# EAGLE design Adafruit NeoKey Trinkey (EAGLE 9.6.2)
AUTHOR: ladyada
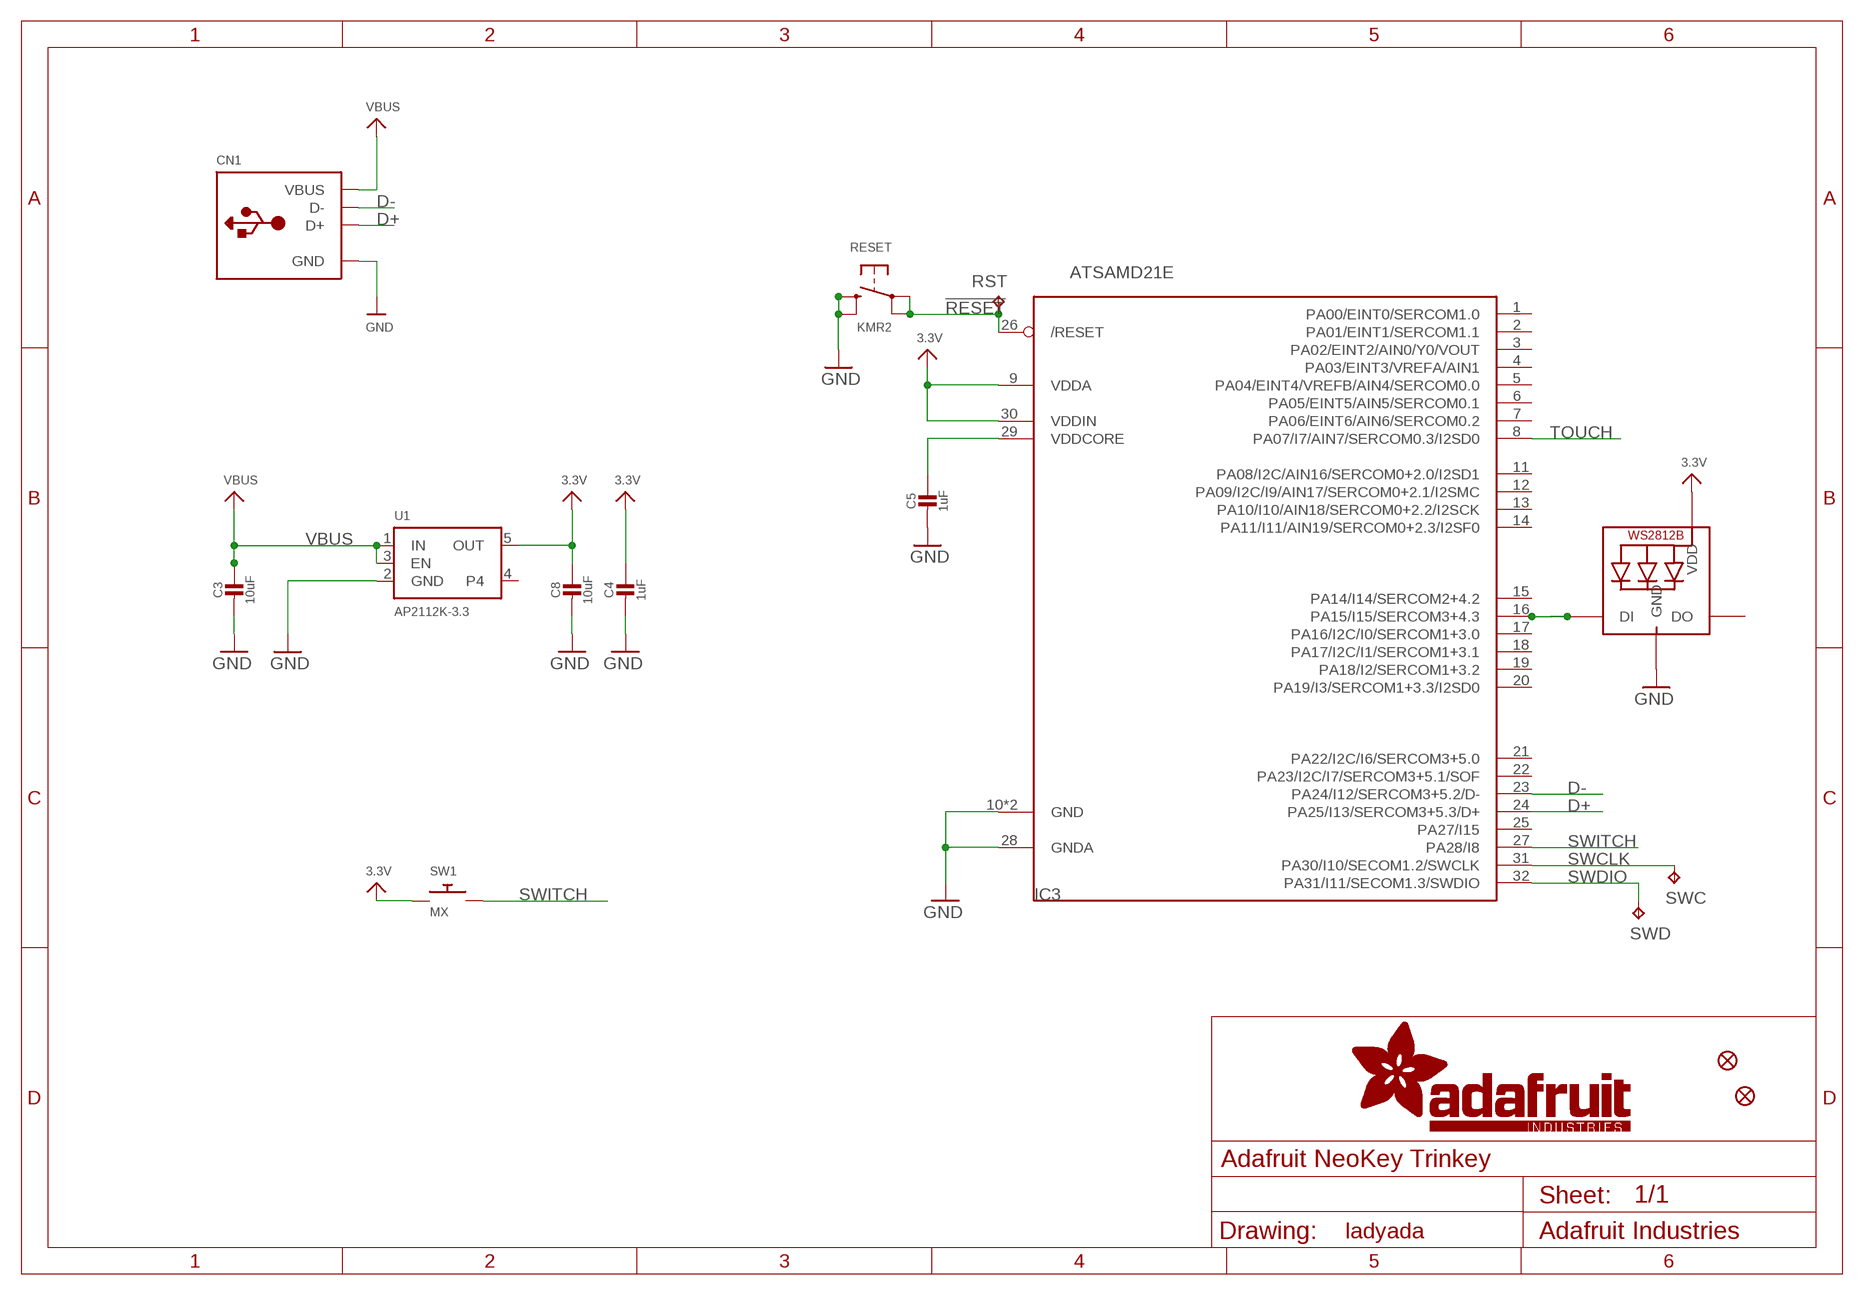
[diagram p0: schematic, sheet 1]

## Parts
C3  10uF  CAP_CERAMIC0805-NOOUTLINE  [0805-NO]
C4  1uF  CAP_CERAMIC0603_NO  [0603-NO]
C5  1uF  CAP_CERAMIC0603_NO  [0603-NO]
C8  10uF  CAP_CERAMIC0805-NOOUTLINE  [0805-NO]
CN1  USB_TYPEAPCB  [USBA_PCB]
FID1  FIDUCIAL_1MM  [FIDUCIAL_1MM]
FID2  FIDUCIAL_1MM  [FIDUCIAL_1MM]
IC3  ATSAMD21E  [QFN32_5MM]
LED1  WS2812B_SK6812E  [NEO3535_REVERSE]
RESET  KMR2  SWITCH_TACT_SMT4.6X2.8  [BTN_KMR2_4.6X2.8]
RST  RST  TPTP16R  [TP16R]
SW1  MX  SWITCH_PUSHBUTTON_KAILH_THMSIMPLE  [KAILH_BOX_MX_NOSTABILIZERS]
SWC  SWC  TPTP15R  [TP15R]
SWD  SWD  TPTP15R  [TP15R]
U1  AP2112K-3.3  VREG_SOT23-5  [SOT23-5]

## Nets
3.3V: C4.1 C8.1 IC3.9(VDDA) IC3.30(VDDIN) LED1.1-VDD(VDD) SW1.1 U1.5(OUT)
!RESET: IC3.26(/RESET) RESET.A'(P1) RESET.A(P) RST.TP
D+: CN1.USB_PLUS(D+) IC3.24(PA25/I13/SERCOM3+5.3/D+)
D-: CN1.USB_NEG(D-) IC3.23(PA24/I12/SERCOM3+5.2/D-)
GND: C3.2 C4.2 C5.2 C8.2 CN1.GND IC3.10(GND) IC3.28(GNDA) IC3.33(GND) LED1.3-GND(GND) RESET.B'(S1) RESET.B(S) U1.2(GND)
N$1: IC3.16(PA15/I15/SERCOM3+4.3) LED1.4-DIN(DI)
SWCLK: IC3.31(PA30/I10/SECOM1.2/SWCLK) SWC.TP
SWDIO: IC3.32(PA31/I11/SECOM1.3/SWDIO) SWD.TP
SWITCH: IC3.27(PA28/I8) SW1.2
TOUCH: IC3.8(PA07/I7/AIN7/SERCOM0.3/I2SD0)
VBUS: C3.1 CN1.VCC(VBUS) U1.1(IN) U1.3(EN)
VDDCORE1: C5.1 IC3.29(VDDCORE)
Unconnected: IC3.1(PA00/EINT0/SERCOM1.0) IC3.2(PA01/EINT1/SERCOM1.1) IC3.3(PA02/EINT2/AIN0/Y0/VOUT) IC3.4(PA03/EINT3/VREFA/AIN1) IC3.5(PA04/EINT4/VREFB/AIN4/SERCOM0.0) IC3.6(PA05/EINT5/AIN5/SERCOM0.1) IC3.7(PA06/EINT6/AIN6/SERCOM0.2) IC3.11(PA08/I2C/AIN16/SERCOM0+2.0/I2SD1) IC3.12(PA09/I2C/I9/AIN17/SERCOM0+2.1/I2SMC) IC3.13(PA10/I10/AIN18/SERCOM0+2.2/I2SCK) IC3.14(PA11/I11/AIN19/SERCOM0+2.3/I2SF0) IC3.15(PA14/I14/SERCOM2+4.2) IC3.17(PA16/I2C/I0/SERCOM1+3.0) IC3.18(PA17/I2C/I1/SERCOM1+3.1) IC3.19(PA18/I2/SERCOM1+3.2) IC3.20(PA19/I3/SERCOM1+3.3/I2SD0) IC3.21(PA22/I2C/I6/SERCOM3+5.0) IC3.22(PA23/I2C/I7/SERCOM3+5.1/SOF) IC3.25(PA27/I15) LED1.2-DOUT(DO) U1.4

## Library data of the parts
C3-C5 C8 = microbuilder:CAP_CERAMIC: Ceramic Capacitors For new designs, use the packages preceded by an '_' character since they are more reliable: The following footprints should be used on most boards: _0402 - Standard footprint for regular board layouts _0603 - Standard footprint for regular board layouts _0805 - Standard footprint for regular board layouts _1206 - Standard footprint for regular board layouts For extremely tight-pitch boards where space is at a premium, the following 'micro-pitch' footprints can be used (smaller pads, no silkscreen outline, etc.): _0402MP - Micro-pitch footprint for very dense/compact boards _0603MP - Micro-pitch footprint for very dense/compact boards _0805MP - Micro-pitch footprint for very dense/compact boards _1206MP - Micro-pitch footprint for very dense/compact boards
CN1 = microbuilder:USB_TYPEA: USB - Type A Connectors Male types stick out and are inserted into a PC or matching females parts (these are the connectors used on USB Memory Sticks, etc.). Female parts are generally used for USB Host and accept a male-type connector. SMT - 4UCON: 10017 PTHFML - Digikey: 609-1045-ND, 4UCon: 05241 PCB - Use 2.0mm thick PCBs with this footprint
FID1 FID2 = microbuilder:FIDUCIAL: Fiducial Alignment Points Various fiducial points for machine vision alignment.; BOM: EXCLUDE
IC3 = microbuilder:ATSAMD21E
LED1 = microbuilder:WS2812B
RESET = microbuilder:SWITCH_TACT_SMT: SMT Tact Switches 6x6mm - Digikey: P12940SCT-ND KMR2 (4.6x2.8mm) - Digikey: 401-1426-1-ND EVQ-PQHB55 - Light Touch, 160GF (4.5x4.5mm) - Digikey: P8090SCT-ND KMT0 - KMT021 NGJ LHS (etc.) IP68/Waterproof - Digikey: CKN10289CT-ND
RST SWC SWD = testpad:TP: Test pad
SW1 = adafruit_electromech:SWITCH_PUSHBUTTON: Buttons SOFTTOUCHSMD_SJ - Soft touch temporary push button (Super Junk Akihabara) Compatible with SKPMANE010 [Mouser: 688-SKPMAN] C&K_KSS = Digikey: KSS221GLFS
U1 = microbuilder:VREG_SOT23-5: SOT23-5 Fixed Voltage Regulators Part Current Out V Out V In V Dropout θJA (°C/W) TJ (°C) Digikey Part No. ADP121 150mA 3.3V 3.4-5.5V 0.09V @ 150mA -- -- ADP121-AUJZ33R7CT-ND ADP121 150mA 3.0V 3.1-5.5V 0.09V @ 150mA -- -- ADP121-AUJZ30R7CT-ND ADP122 300mA 3.3V 3.4-5.5V 0.085V @ 300mA -- -- ADP122AUJZ-3.3-R7CT-ND ADP1712 300mA 3.3V 3.5-5.5V 0.17V @ 300mA -- -- ADP1712AUJZ-3.3-R7TR-ND AP7311 (Low Cost) 150mA 3.3V 3.5-6V 0.15V @ 150mA -- -- AP7311-33WG-7DICT-ND LD39015M18R 150mA 1.8V 1.9V-5.5V 0.08V @ 100mA -- -- 497-6977-1-ND LP2985A-33DBVR 150mA 3.3V 3.3-16V 0.28V @ 150mA 206 150 296-18479-1-ND MCP1824T-3302E/OT 300mA 3.3V 3.5V-6V 0.2V @ 300mA -- -- MCP1824T-3302E/OTCT-ND MIC5205-2.5YM5 TR 150mA 2.5V 2.7-16V 0.165V @ 150mA -- -- 576-1257-2-ND MIC5205-3.0YM5 TR 150mA 3.0V 3.2V-16V 0.165V @ 150mA -- -- 576-1258-2-ND MIC5205-3.3YM5 TR 150mA 3.3V 3.5V-16V 0.165V @ 150mA -- -- 576-1259-2-ND TPS780330220 150mA 3.3V+2.2V 3.6-5.5V 250mV Max -- -- 296-23332-1-ND TDA3663/N1,135 100mA 3.3V 3.5-45V 0.18V @ 50mA -- -- 568-5343-1-ND Max operating temp can be calculated using θJA, TJ (max junction temperature), and power in watts. Set the "Maximum Ambient Temperature" until it reaches TJ ("Max Junction Temperature"), which is the absolute limit for safe use of the regulator: Heat Sink Temperature Calculator <http://www.daycounter.com/Calculators/Heat-Sink-Temperature-Calculator.phtml> For example, With 12V source into a 3.3V LP2985 and a 30mA load, we are dissipating (12V-3.3V) * 0.03A = 0.261W. With a θJA of 206 °C/W, a TJ of 150°C, and 261mW we can safely use the chip without a heat sink up to 75°C (=147.1°C Junction Temperature).

## Board
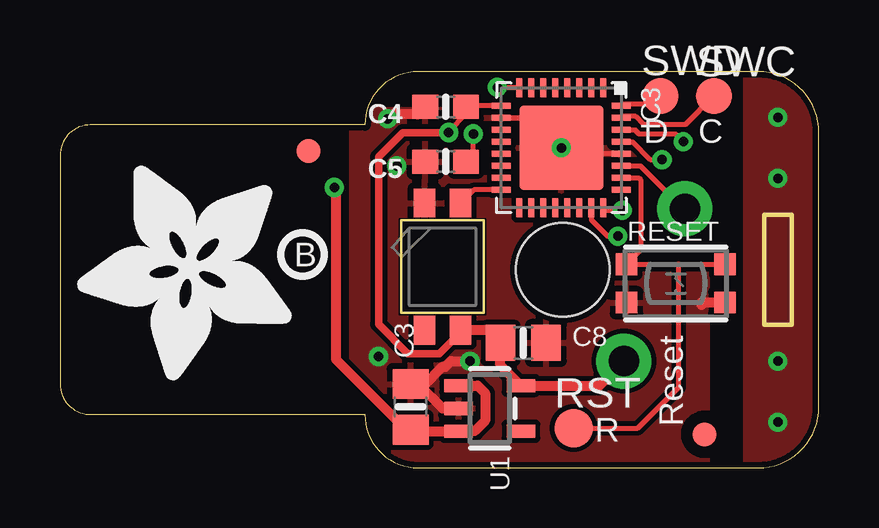
[diagram p1: board, top side]
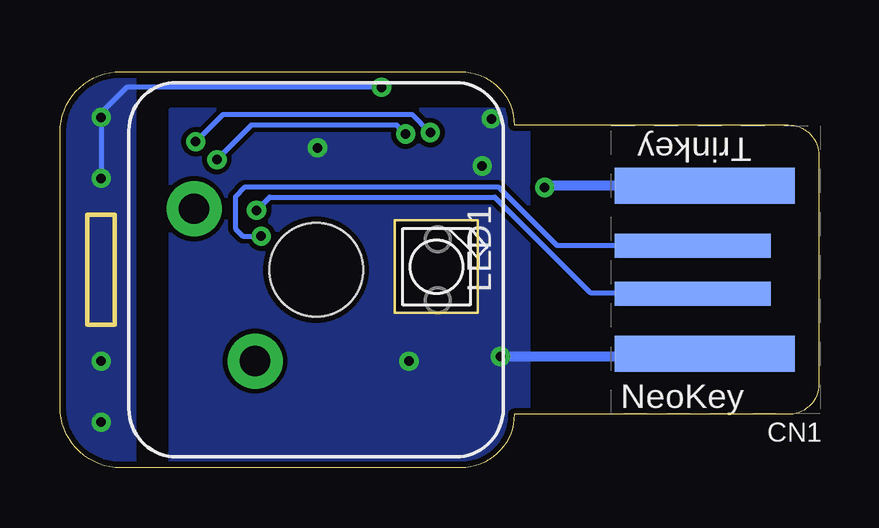
[diagram p2: board, bottom side, seen from below]

Size 31.62 x 16.51 mm. Coordinates in mm from the lower left corner, seen from the top.
Outline: 31.62,4.19 31.62,2.54 arc-90 29.08,0 14.92,0 arc-90 12.7,2.22 1.3,2.22 arc-90 0,3.49 0,13.02 arc-90 1.27,14.29 12.7,14.29 arc-90 14.92,16.51 29.08,16.51 arc-90 31.62,13.97 31.62,3.81
Copper layers (1*16): Top 0.035mm / dielectric 1.5mm / Bottom 0.035mm
Design rules "adafruit 8-8 *": minimum track width 8mil, minimum drill 15.5mil, track to track 8mil, track to pad 8mil, pad to pad 8mil, via to via 8mil, smd to smd 8mil, copper to edge 10mil, drill to drill 8mil, minimum pad ring 10mil, minimum via ring 8mil, stop-mask expansion 2mil, vias tented up to drill 20mil, thermal gap 10mil
Milling: 4 lines

### Footprints (pad centres in the part's own frame; a part is rotated, then mirrored left to right if it is on the bottom)
0805-NO = smd 1.24 x 1.5: 1 -0.95,0; 2 0.95,0
0603-NO = smd 1.075 x 1: 1 -0.85,0; 2 0.85,0
USBA_PCB = smd 7.5 x 1.5: GND -0.2,3.5; VCC -0.2,-3.5 | smd 6.5 x 1: USB_NEG 0.3,-1; USB_PLUS 0.3,1
FIDUCIAL_1MM = smd 1 x 1: 1 0,0
QFN32_5MM = smd 0.8 x 0.25: 1 -2.5,1.75; 2 -2.5,1.25; 3 -2.5,0.75; 4 -2.5,0.25; 5 -2.5,-0.25; 6 -2.5,-0.75; 7 -2.5,-1.25; 8 -2.5,-1.75; 17 2.5,-1.75; 18 2.5,-1.25; 19 2.5,-0.75; 20 2.5,-0.25; 21 2.5,0.25; 22 2.5,0.75; 23 2.5,1.25; 24 2.5,1.75 | smd 0.25 x 0.8: 9 -1.75,-2.5; 10 -1.25,-2.5; 11 -0.75,-2.5; 12 -0.25,-2.5; 13 0.25,-2.5; 14 0.75,-2.5; 15 1.25,-2.5; 16 1.75,-2.5; 25 1.75,2.5; 26 1.25,2.5; 27 0.75,2.5; 28 0.25,2.5; 29 -0.25,2.5; 30 -0.75,2.5; 31 -1.25,2.5; 32 -1.75,2.5 | smd 3.5 x 3.5: 33 0,0
NEO3535_REVERSE = smd 1.2 x 0.9 bottom: 1-VDD 2.65,-0.75; 2-DOUT 2.65,0.75; 3-GND -2.65,0.75; 4-DIN -2.65,-0.75
BTN_KMR2_4.6X2.8 = smd 0.9 x 0.9: A 2.05,0.8; A' -2.05,0.8; B 2.05,-0.8; B' -2.05,-0.8
TP16R = smd 1.6 x 1.6: TP 0,0
KAILH_BOX_MX_NOSTABILIZERS = drill 1.27 pad 2.286: 1 -3.81,2.54; 2 2.54,5.08 | hole 3.9: 0,0
TP15R = smd 1.5 x 1.5: TP 0,0
SOT23-5 = smd 0.55 x 1.2: 1 -0.95,-1.3; 2 0,-1.3; 3 0.95,-1.3; 4 0.95,1.3; 5 -0.95,1.3

### Placement (x,y rotation side)
C3  14.61,2.54 90 top
C4  16.07,15.05 180 top
C5  16.07,12.76 180 top
C8  19.3,5.21 0 top
CN1  4.95,8.26 180 bottom
FID1  26.86,1.4 0 top
FID2  10.36,13.21 180 top
IC3  20.89,13.34 270 top
LED1  15.94,8.38 270 bottom
RESET  25.65,7.68 0 top
RST  21.4,1.65 0 top
SW1  20.95,8.26 90 bottom
SWC  27.24,15.49 0 top
SWD  25.02,15.49 0 top
U1  17.91,2.48 270 top
U$6  [ADAFRUIT_9MM]  9.65,12.57 180 top
U$8  [PCBFEAT-REV-040]  10.1,8.89 0 top

### Tracks (layer width: path | path; a pad name or v marks a point on that pad's centre or on a via)
3.3V  (via drill 0.39)
  Top 0.203: IC3.9 17.16,15.09 C4.1 16.92,14.76 16.19,14.03 v16.19,13.97 | IC3.30 23.95,14.09 24.13,13.91 25.65,13.91 v25.97,13.59
  Top 0.305: v16.19,13.97 14.29,13.97 13.27,12.95 13.27,5.99 14.5,4.76 15.81,4.76 16.69,5.64 LED1.1-VDD
  Top 0.406: LED1.1-VDD 17.83,5.73 C8.1 18.35,4.28 U1.5 22.48,3.43 SW1.1
  Bottom 0.203: v25.97,13.59 24.83,14.73 16.95,14.73 v16.19,13.97
!RESET
  Top 0.203: IC3.26 24.11,12.09 24.19,12 24.19,9.07 RESET.A' 25.78,8.48 | 25.78,8.48 RESET.A | RST.TP 24.07,1.65 25.78,3.37 25.78,8.48
D+  (via drill 0.39)
  Top 0.203: IC3.24 22.75,10.73 v23.43,10.73
  Bottom 0.203: v23.43,10.73 22.89,11.28 13.5,11.28 9.53,7.3 6.67,7.3 6.6,7.37 5.36,7.37 CN1.USB_PLUS
D-  (via drill 0.39)
  Top 0.203: IC3.23 22.14,10.33 22.82,9.65 v23.24,9.65
  Bottom 0.203: CN1.USB_NEG 10.91,9.26 13.34,11.68 23.94,11.68 24.32,11.3 24.32,9.97 24,9.65 v23.24,9.65
GND  (via drill 0.39)
  Top 0.203: IC3.10 20.19,14.59 20.19,13.34 20.57,13.34 | 20.57,13.34 IC3.33 | IC3.28 20.57,13.09 20.57,13.34
  Top 0.406: U1.2 15.94,2.48 14.93,3.49 C3.2 15.22,3.49 15.93,4.2 16.04,4.2 16.28,4.45 v17.08,4.45 | RESET.B 26.73,6.88 26.73,6.8 | C4.2 14.9,14.73 13.78,14.73
  Bottom 0.406: CN1.GND 4.75,4.64 v13.27,4.64
  other vias: 20.89,13.34 13.65,14.54 14.03,12.57
  pour Top: 12.13,0.06 26.99,0.06 26.99,14.92 12.13,14.92
  pour Bottom: 12.13,0.06 26.99,0.06 26.99,14.92 12.13,14.92
N$1
  Top 0.203: IC3.16 17.24,11.59 LED1.4-DIN
SWCLK
  Top 0.203: IC3.31 23.45,14.65 23.98,14.65 24.31,14.33 26.07,14.33 SWC.TP
SWDIO
  Top 0.203: IC3.32 23.45,15.15 24.74,15.15 SWD.TP
SWITCH
  Top 0.203: IC3.27 24.18,12.59 25.97,10.8 SW1.2
TOUCH  (via drill 0.39)
  Top 0.203: IC3.8 18.25,15.84 v18.22,15.86
  Bottom 0.203: v18.22,15.86 28.85,15.86 29.91,14.8 v29.91,12.07
  other vias: 29.91,4.45 29.91,1.91 29.91,14.61
  pour Bottom: 28.57,-0.06 31.69,-0.06 31.69,16.51 28.57,16.51
  pour Top: 28.57,-0.06 31.69,-0.06 31.69,16.51 28.57,16.51
VBUS  (via drill 0.39)
  Top 0.406: v11.43,11.68 11.49,11.62 11.49,4.53 14.43,1.59 C3.1 14.67,1.53 U1.3 17.27,1.53 17.72,1.97 17.72,3.11 17.4,3.43 U1.1
  Bottom 0.406: CN1.VCC 11.36,11.76 v11.43,11.68
VDDCORE1  (via drill 0.39)
  Top 0.203: IC3.29 23.86,13.59 24.6,12.84 v25.08,12.84 | C5.1 17.22,13.07 v17.22,13.91
  Bottom 0.203: v25.08,12.84 23.64,14.29 17.6,14.29 v17.22,13.91

### Text on the board
tPlace: D | C | Reset | R
bPlace: Trinkey | NeoKey